# Altium project Strawberry Pi.PrjPcb (part 2 of 2)

## Sheet [14] - CO-PROCESSOR.SchDoc: DOCUMENT TITLE
size A4; Organization: Bjørn T. Brodtkorb; Address1: Frode Rinnans veg 161; Address2: 7050 Trondheim; DocumentNumber: 6598; Revision: 1.0; SheetNumber: 1; SheetTotal: 1
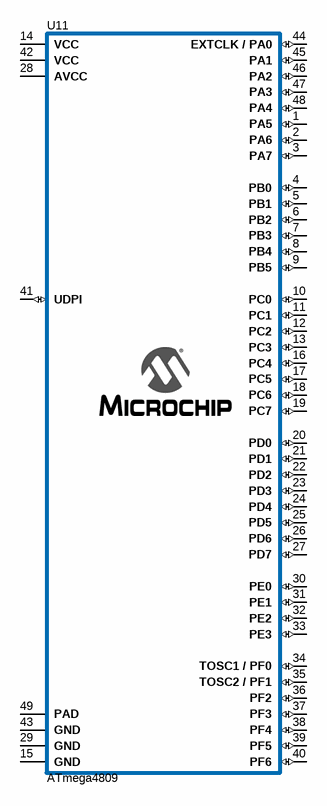
[diagram p14: [14] - CO-PROCESSOR.SchDoc]

### Parts
U11  ATmega4809  [ATMEGA4809-MFR]

### Nets

Not connected (* = marked no-connect by the designer): U11 1(PA5) 2(PA6) 3(PA7) 4(PB0) 5(PB1) 6(PB2) 7(PB3) 8(PB4) 9(PB5) 10(PC0) 11(PC1) 12(PC2) 13(PC3) 14(VCC) 15(GND) 16(PC4) 17(PC5) 18(PC6) 19(PC7) 20(PD0) 21(PD1) 22(PD2) 23(PD3) 24(PD4) 25(PD5) 26(PD6) 27(PD7) 28(AVCC) 29(GND) 30(PE0) 31(PE1) 32(PE2) 33(PE3) 34(TOSC1_/_PF0) 35(TOSC2_/_PF1) 36(PF2) 37(PF3) 38(PF4) 39(PF5) 40(PF6) 41(UDPI) 42(VCC) 43(GND) 44(EXTCLK_/_PA0) 45(PA1) 46(PA2) 47(PA3) 48(PA4) 49(PAD)

### Notes on the sheet
- Title
- Size:
- A4
- Number:
- Revision:
- Date:
- File:
- Time:
- Sheet
- of

### Library data of the parts
U11 = ATMEGA4809-MFR: ATmega4809 UQFN; Supplier Part Number 1: 2900707; Supplier 1: Farnell

## Nets that join several sheets
+1V8: [08] - AUDIO (L3.1 L4.1), [12] - POWER (C56.2 U6.5)
+3V3: [06] - MEMORY (16 pins), [07] - USB HUB (17 pins), [08] - AUDIO (L5.1 R68.2 R69.2), [09] - ETHERNET (13 pins), [11] - IO (R88.1 R90.1 R91.1), [12] - POWER (C53.2 L6.1 U5.5), [13] - CONNECTORS (14 pins)
+5V: [09] - ETHERNET (C57.2 U7.1 U7.3), [10] - FTDI (C73.1 C79.1 F3.1 F4.1), [12] - POWER (6 pins), [13] - CONNECTORS (7 pins)
CPU_3V3: [03] - CPU POWER (16 pins), [05] - CPU CRITICAL SIGNALS (L2.1 R18.2 R19.2 R20.2), [12] - POWER (C54.2 L6.2)
GND: [03] - CPU POWER (24 pins), [04] - CPU IO (C19.1 C20.1 X1.2 X1.4), [05] - CPU CRITICAL SIGNALS (6 pins), [06] - MEMORY (16 pins), [07] - USB HUB (21 pins), [09] - ETHERNET (28 pins), [10] - FTDI (18 pins), [11] - IO (C85.1 R89.2), [12] - POWER (7 pins), [13] - CONNECTORS (23 pins)
DRAM_A0: [04] - CPU IO (U1.120), [06] - MEMORY (R22.1)
DRAM_A1: [04] - CPU IO (U1.122), [06] - MEMORY (R24.1)
DRAM_A2: [04] - CPU IO (U1.124), [06] - MEMORY (R26.1)
DRAM_A3: [04] - CPU IO (U1.127), [06] - MEMORY (R28.1)
DRAM_A4: [04] - CPU IO (U1.130), [06] - MEMORY (R30.1)
DRAM_A5: [04] - CPU IO (U1.133), [06] - MEMORY (R32.1)
DRAM_A6: [04] - CPU IO (U1.13), [06] - MEMORY (R34.1)
DRAM_A7: [04] - CPU IO (U1.12), [06] - MEMORY (R36.1)
DRAM_A8: [04] - CPU IO (U1.76), [06] - MEMORY (R38.1)
DRAM_A9: [04] - CPU IO (U1.16), [06] - MEMORY (R40.1)
DRAM_A10: [04] - CPU IO (U1.88), [06] - MEMORY (R42.1)
DRAM_A11: [04] - CPU IO (U1.14), [06] - MEMORY (R44.1)
DRAM_A12: [04] - CPU IO (U1.24), [06] - MEMORY (R46.1)
DRAM_BA0: [04] - CPU IO (U1.22), [06] - MEMORY (R59.1)
DRAM_BA1: [04] - CPU IO (U1.102), [06] - MEMORY (R60.1)
DRAM_CAS: [04] - CPU IO (U1.74), [06] - MEMORY (R53.1)
DRAM_CKE: [04] - CPU IO (U1.84), [06] - MEMORY (R57.1)
DRAM_CLK: [04] - CPU IO (U1.57), [06] - MEMORY (R55.1)
DRAM_CS: [04] - CPU IO (U1.18), [06] - MEMORY (R50.1)
DRAM_D0: [04] - CPU IO (R4.1), [06] - MEMORY (R23.2), [13] - CONNECTORS (R92.2)
DRAM_D1: [04] - CPU IO (R5.1), [06] - MEMORY (R25.2), [13] - CONNECTORS (R93.2)
DRAM_D2: [04] - CPU IO (R6.1), [06] - MEMORY (R27.2), [13] - CONNECTORS (R94.2)
DRAM_D3: [04] - CPU IO (R7.1), [06] - MEMORY (R29.2), [13] - CONNECTORS (R95.2)
DRAM_D4: [04] - CPU IO (R8.1), [06] - MEMORY (R31.2), [13] - CONNECTORS (R96.2)
DRAM_D5: [04] - CPU IO (R9.1), [06] - MEMORY (R33.2), [13] - CONNECTORS (R97.2)
DRAM_D6: [04] - CPU IO (R10.1), [06] - MEMORY (R35.2), [13] - CONNECTORS (R98.2)
DRAM_D7: [04] - CPU IO (R11.1), [06] - MEMORY (R37.2), [13] - CONNECTORS (R99.2)
DRAM_D8: [04] - CPU IO (R12.2), [06] - MEMORY (R39.2), [13] - CONNECTORS (R100.2)
DRAM_D9: [04] - CPU IO (R13.2), [06] - MEMORY (R41.2), [13] - CONNECTORS (R101.2)
DRAM_D10: [04] - CPU IO (R14.2), [06] - MEMORY (R43.2), [13] - CONNECTORS (R102.2)
DRAM_D11: [04] - CPU IO (R15.2), [06] - MEMORY (R45.2), [13] - CONNECTORS (R103.2)
DRAM_D12: [04] - CPU IO (R16.2), [06] - MEMORY (R47.2), [13] - CONNECTORS (R104.2)
DRAM_D13: [04] - CPU IO (R17.2), [06] - MEMORY (R48.2), [13] - CONNECTORS (R105.2)
DRAM_D14: [04] - CPU IO (R2.2), [06] - MEMORY (R49.2), [13] - CONNECTORS (R107.2)
DRAM_D15: [04] - CPU IO (R3.2), [06] - MEMORY (R51.2), [13] - CONNECTORS (R106.2)
DRAM_DQMH: [04] - CPU IO (U1.106), [06] - MEMORY (R56.2)
DRAM_DQML: [04] - CPU IO (U1.111), [06] - MEMORY (R58.2)
DRAM_RAS: [04] - CPU IO (U1.78), [06] - MEMORY (R52.1)
DRAM_WE: [04] - CPU IO (U1.108), [06] - MEMORY (R54.1)
ETH_CSR: [04] - CPU IO (U1.126), [09] - ETHERNET (R81.2 U8.13)
ETH_MDC: [04] - CPU IO (U1.113), [09] - ETHERNET (U8.11)
ETH_MDIO: [04] - CPU IO (U1.110), [09] - ETHERNET (R70.2 U8.10)
ETH_REF_CLK: [04] - CPU IO (U1.1), [09] - ETHERNET (R76.2 U8.19)
ETH_RXD0: [04] - CPU IO (U1.125), [09] - ETHERNET (R82.1 U8.18)
ETH_RXD1: [04] - CPU IO (U1.121), [09] - ETHERNET (R80.1 U8.17)
ETH_RXER: [04] - CPU IO (U1.119), [09] - ETHERNET (R78.1 U8.12)
ETH_TXD0: [04] - CPU IO (U1.131), [09] - ETHERNET (U8.22)
ETH_TXD1: [04] - CPU IO (U1.128), [09] - ETHERNET (U8.23)
ETH_TXEN: [04] - CPU IO (U1.132), [09] - ETHERNET (U8.21)
FTDI_USB_1_N: [10] - FTDI (C77.1 R85.1), [13] - CONNECTORS (J8.2)
FTDI_USB_1_P: [10] - FTDI (C76.1 R84.1), [13] - CONNECTORS (J8.3)
FTDI_USB_2_N: [10] - FTDI (C83.1 R87.1), [13] - CONNECTORS (J9.2)
FTDI_USB_2_P: [10] - FTDI (C82.1 R86.1), [13] - CONNECTORS (J9.3)
LCD_CMD_DATA: [04] - CPU IO (U1.93), [13] - CONNECTORS (J4.33)
LCD_CS: [04] - CPU IO (U1.67), [13] - CONNECTORS (J4.34)
LCD_RE: [04] - CPU IO (U1.94), [13] - CONNECTORS (J4.36)
LCD_WE: [04] - CPU IO (U1.82), [13] - CONNECTORS (J4.35)
NetJ6_2: [05] - CPU CRITICAL SIGNALS (R18.1 TP2.1 U1.83), [13] - CONNECTORS (J6.2 J11.10)
NetJ11_2: [05] - CPU CRITICAL SIGNALS (R19.1 U1.79), [13] - CONNECTORS (J11.2)
NetJ11_4: [05] - CPU CRITICAL SIGNALS (R20.1 U1.89), [13] - CONNECTORS (J11.4)
NetJ11_6: [05] - CPU CRITICAL SIGNALS (U1.109), [13] - CONNECTORS (J11.6)
NetJ12_1: [04] - CPU IO (U1.62), [13] - CONNECTORS (J12.1 R115.1)
NetJ12_2: [04] - CPU IO (U1.70), [13] - CONNECTORS (J12.2 R116.1)
NetJ12_3: [04] - CPU IO (U1.112), [13] - CONNECTORS (J12.3 R117.1)
NetJ12_5: [04] - CPU IO (U1.59), [13] - CONNECTORS (J12.5)
NetJ12_7: [04] - CPU IO (U1.116), [13] - CONNECTORS (J12.7 R113.1)
NetJ12_8: [04] - CPU IO (U1.118), [13] - CONNECTORS (J12.8 R114.1)
USB_DOWN_1_N: [07] - USB HUB (U3.1), [13] - CONNECTORS (J3.2)
USB_DOWN_1_P: [07] - USB HUB (U3.2), [13] - CONNECTORS (J3.3)
USB_DOWN_2_N: [07] - USB HUB (U3.3), [13] - CONNECTORS (J5.2)
USB_DOWN_2_P: [07] - USB HUB (U3.4), [13] - CONNECTORS (J5.3)
USB_DOWN_3_N: [07] - USB HUB (U3.6), [13] - CONNECTORS (J7.2)
USB_DOWN_3_P: [07] - USB HUB (U3.7), [13] - CONNECTORS (J7.3)
USB_ROOT_N: [05] - CPU CRITICAL SIGNALS (U1.137), [07] - USB HUB (U3.30)
USB_ROOT_P: [05] - CPU CRITICAL SIGNALS (U1.136), [07] - USB HUB (U3.31)